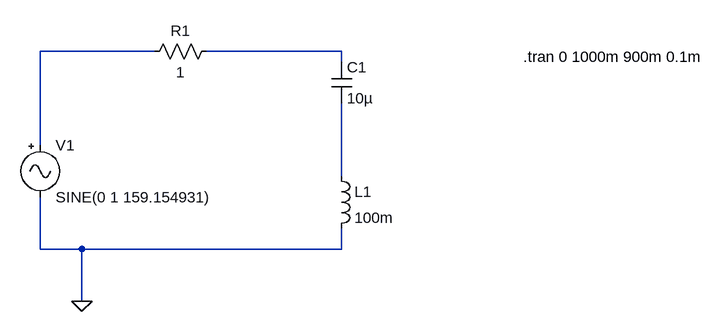
[diagram p0: schematic AC_LC_series.asc]
AC_LC_series.asc, the LTspice schematic file:
Version 4.1
SHEET 1 1128 680
WIRE 256 -16 80 -16
WIRE 544 -16 336 -16
WIRE 544 0 544 -16
WIRE 80 128 80 -16
WIRE 544 176 544 64
WIRE 80 288 80 208
WIRE 144 288 80 288
WIRE 544 288 544 256
WIRE 544 288 144 288
WIRE 144 368 144 288
FLAG 144 368 0
SYMBOL Misc\\signal 80 112 R0
WINDOW 123 0 0 Left 0
WINDOW 39 0 0 Left 0
SYMATTR InstName V1
SYMATTR Value SINE(0 1 159.154931)
SYMBOL cap 528 0 R0
SYMATTR InstName C1
SYMATTR Value 10µ
SYMATTR SpiceLine Rser=0
SYMBOL ind 528 160 R0
SYMATTR InstName L1
SYMATTR Value 100m
SYMATTR SpiceLine Rser=0
SYMBOL res 240 0 R270
WINDOW 0 32 56 VTop 2
WINDOW 3 0 56 VBottom 2
SYMATTR InstName R1
SYMATTR Value 1
TEXT 824 -8 Left 2 !.tran 0 1000m 900m 0.1m

The netlist it stands for:
* AC_LC_series.asc
V1 N001 0 SINE(0 1 159.154931)
C1 N002 N003 10µ Rser=0
L1 N003 0 100m Rser=0
R1 N001 N002 1
.tran 0 1000m 900m 0.1m
.backanno
.end